# Altium schematic sheet BV10011_ControlEtherCAT.SchDoc: EtherCAT tranceiver
size A2; SheetNumber: 4; SheetTotal: 6
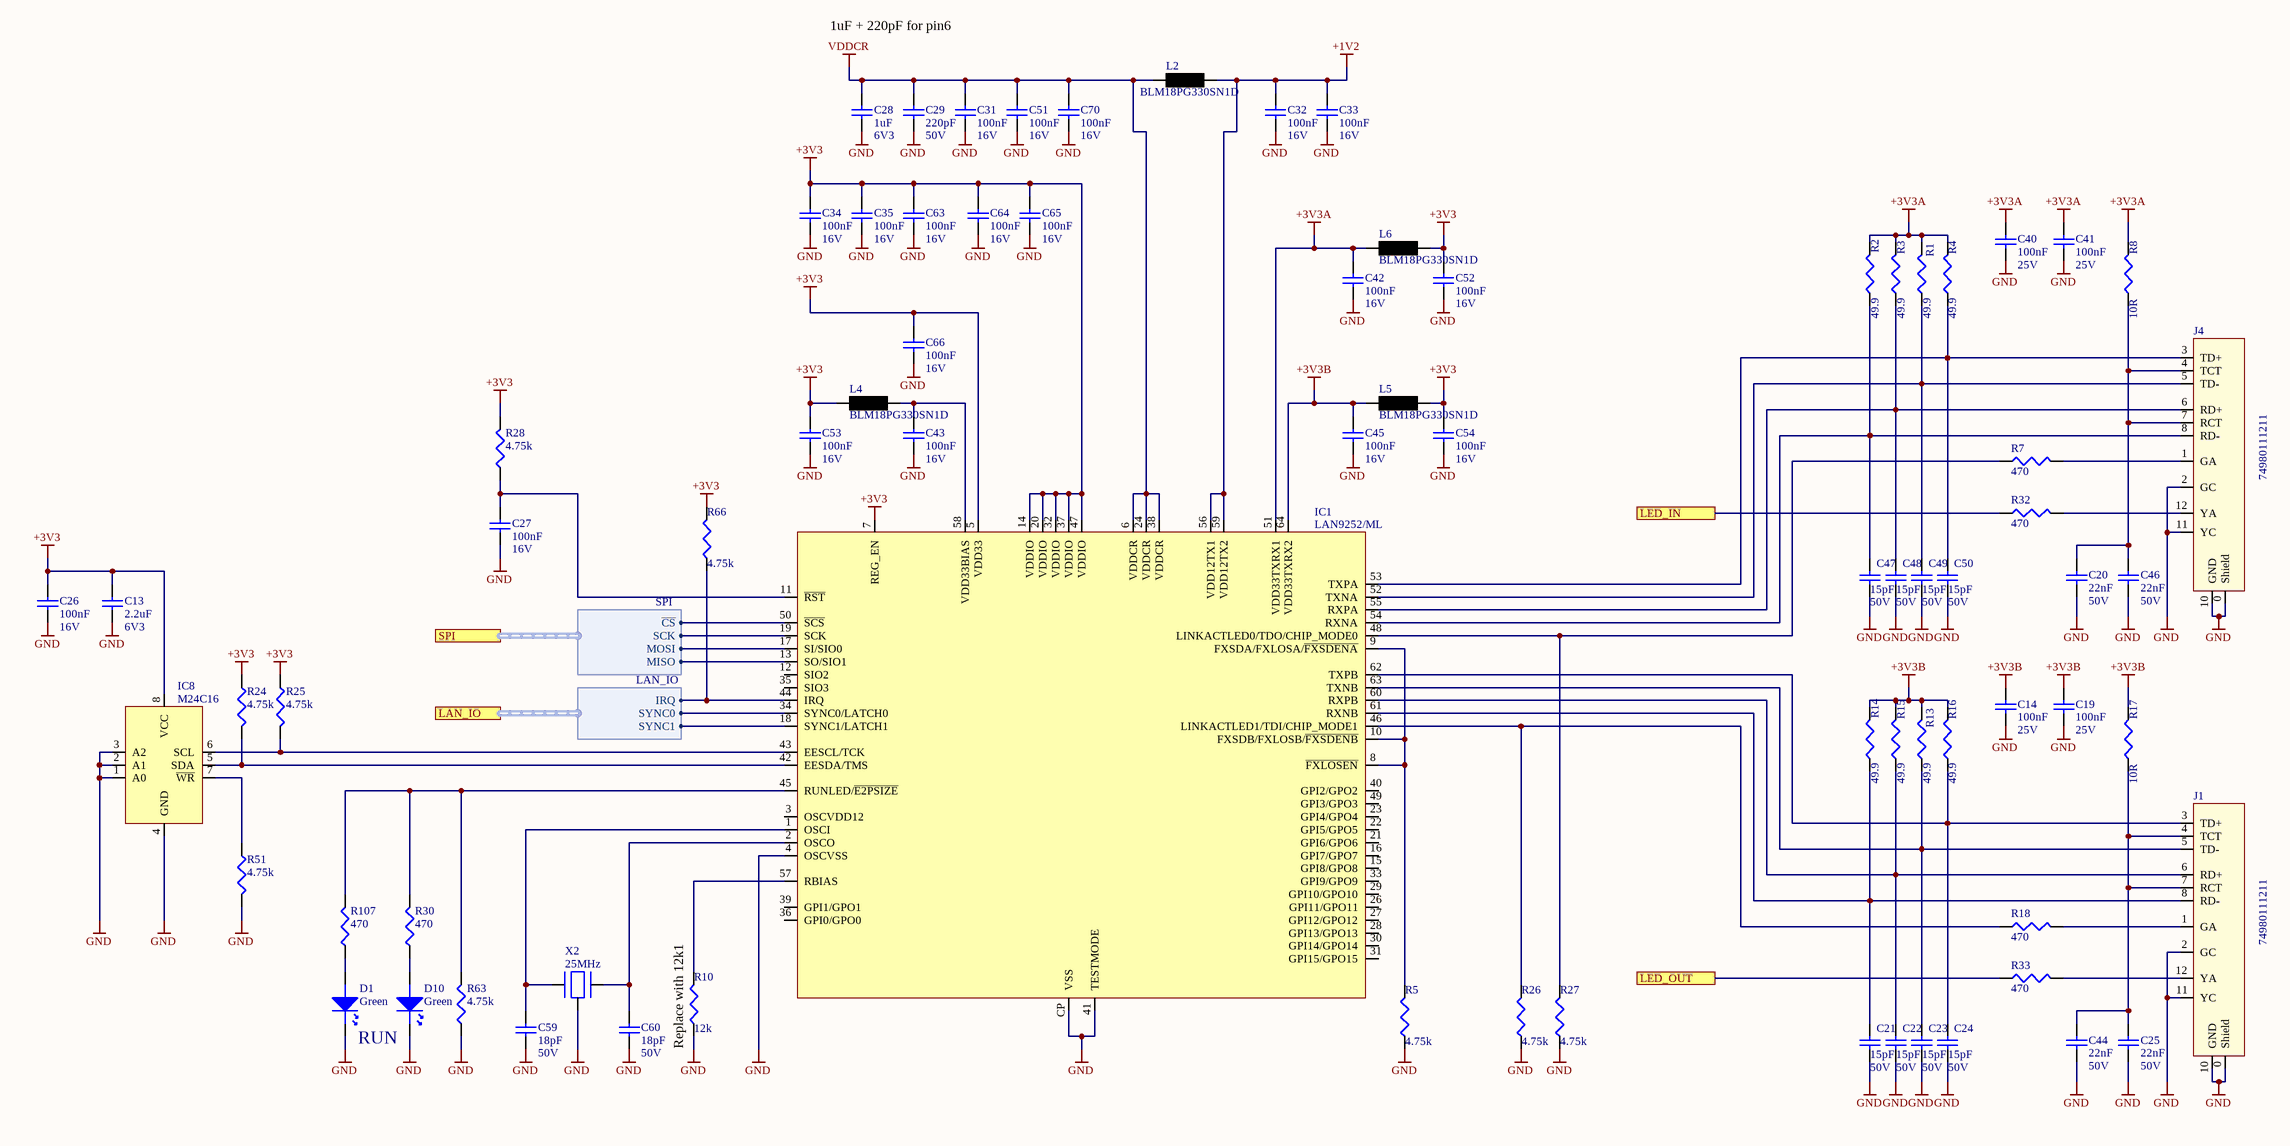
[diagram p0: BV10011_ControlEtherCAT.SchDoc]

## Parts
C13  2.2uF  Voltage Rating: 6V3  [C0402]
C14  100nF  Voltage Rating: 25V  [C0402]
C19  100nF  Voltage Rating: 25V  [C0402]
C20  22nF  Voltage Rating: 50V  [C0402]
C21  15pF  Voltage Rating: 50V  [C0402]
C22  15pF  Voltage Rating: 50V  [C0402]
C23  15pF  Voltage Rating: 50V  [C0402]
C24  15pF  Voltage Rating: 50V  [C0402]
C25  22nF  Voltage Rating: 50V  [C0402]
C26  100nF  Voltage Rating: 16V  [C0402]
C27  100nF  Voltage Rating: 16V  [C0402]
C28  1uF  Voltage Rating: 6V3  [C0402]
C29  220pF  Voltage Rating: 50V  [C0402]
C31  100nF  Voltage Rating: 16V  [C0402]
C32  100nF  Voltage Rating: 16V  [C0402]
C33  100nF  Voltage Rating: 16V  [C0402]
C34  100nF  Voltage Rating: 16V  [C0402]
C35  100nF  Voltage Rating: 16V  [C0402]
C40  100nF  Voltage Rating: 25V  [C0402]
C41  100nF  Voltage Rating: 25V  [C0402]
C42  100nF  Voltage Rating: 16V  [C0402]
C43  100nF  Voltage Rating: 16V  [C0402]
C44  22nF  Voltage Rating: 50V  [C0402]
C45  100nF  Voltage Rating: 16V  [C0402]
C46  22nF  Voltage Rating: 50V  [C0402]
C47  15pF  Voltage Rating: 50V  [C0402]
C48  15pF  Voltage Rating: 50V  [C0402]
C49  15pF  Voltage Rating: 50V  [C0402]
C50  15pF  Voltage Rating: 50V  [C0402]
C51  100nF  Voltage Rating: 16V  [C0402]
C52  100nF  Voltage Rating: 16V  [C0402]
C53  100nF  Voltage Rating: 16V  [C0402]
C54  100nF  Voltage Rating: 16V  [C0402]
C59  18pF  Voltage Rating: 50V  [C0402]
C60  18pF  Voltage Rating: 50V  [C0402]
C63  100nF  Voltage Rating: 16V  [C0402]
C64  100nF  Voltage Rating: 16V  [C0402]
C65  100nF  Voltage Rating: 16V  [C0402]
C66  100nF  Voltage Rating: 16V  [C0402]
C70  100nF  Voltage Rating: 16V  [C0402]
D1  Green  [D-0805]
D10  Green  [D-0805]
IC1  LAN9252/ML  [QFN64_Rect]
IC8  M24C16  [SO-8]
J1  74980111211  [74980111211]
J4  74980111211  [74980111211]
L2  BLM18PG330SN1D  [L0603]
L4  BLM18PG330SN1D  [L0603]
L5  BLM18PG330SN1D  [L0603]
L6  BLM18PG330SN1D  [L0603]
R1  49.9  [0402]
R2  49.9  [0402]
R3  49.9  [0402]
R4  49.9  [0402]
R5  4.75k  [0402]
R7  470  [0402]
R8  10R  [0603]
R10  12k  [0402]
R13  49.9  [0402]
R14  49.9  [0402]
R15  49.9  [0402]
R16  49.9  [0402]
R17  10R  [0603]
R18  470  [0402]
R24  4.75k  [0402]
R25  4.75k  [0402]
R26  4.75k  [0402]
R27  4.75k  [0402]
R28  4.75k  [0402]
R30  470  [0402]
R32  470  [0402]
R33  470  [0402]
R51  4.75k  [0402]
R63  4.75k  [0402]
R66  4.75k  [0402]
R107  470  [0402]
X2  25MHz  [7M]

## Ports
LAN_IO (harness LAN_IO), LED_IN, LED_OUT, SPI (harness SPI)

## Harnesses
SPI: SCK, ~{CS}, MOSI, MISO
LAN_IO: IRQ, SYNC0, SYNC1

## Nets
+1V2: C32.2 C33.2 IC1.56(VDD12TX1) IC1.59(VDD12TX2) L2.2
+3V3: C13.2 C26.2 C34.2 C35.2 C52.2 C53.2 C54.2 C63.2 C64.2 C65.2 C66.2 IC1.5(VDD33) IC1.7(REG_EN) IC1.14(VDDIO) IC1.20(VDDIO) IC1.32(VDDIO) IC1.37(VDDIO) IC1.47(VDDIO) IC8.8(VCC) L4.2 L5.2 L6.2 R24.2 R25.2 R28.2 R66.2
+3V3A: C40.2 C41.2 C42.2 IC1.51(VDD33TXRX1) L6.1 R1.2 R2.2 R3.2 R4.2 R8.2
+3V3B: C14.2 C19.2 C45.2 IC1.64(VDD33TXRX2) L5.1 R13.2 R14.2 R15.2 R16.2 R17.2
GND: C13.1 C14.1 C19.1 C20.1 C21.1 C22.1 C23.1 C24.1 C25.1 C26.1 C27.1 C28.1 C29.1 C31.1 C32.1 C33.1 C34.1 C35.1 C40.1 C41.1 C42.1 C43.1 C44.1 C45.1 C46.1 C47.1 C48.1 C49.1 C50.1 C51.1 C52.1 C53.1 C54.1 C59.1 C60.1 C63.1 C64.1 C65.1 C66.1 C70.1 D1.K D10.K IC1.4(OSCVSS) IC1.41(TESTMODE) IC1.CP(VSS) IC8.1(A0) IC8.2(A1) IC8.3(A2) IC8.4(GND) J1.0(Shield) J1.2(GC) J1.10(GND) J1.11(YC) J4.0(Shield) J4.2(GC) J4.10(GND) J4.11(YC) R5.1 R10.1 R26.1 R27.1 R51.1 R63.1 X2.0
VDDCR: C28.2 C29.2 C31.2 C51.2 C70.2 IC1.6(VDDCR) IC1.24(VDDCR) IC1.38(VDDCR) L2.1
LED_IN: R32.1 ; port LED_IN
LED_OUT: R33.1 ; port LED_OUT
NetC20_2: C20.2 C46.2 J4.4(TCT) J4.7(RCT) R8.1
NetC21_2: C21.2 IC1.61(RXNB) J1.8(RD-) R14.1
NetC22_2: C22.2 IC1.60(RXPB) J1.6(RD+) R15.1
NetC23_2: C23.2 IC1.63(TXNB) J1.5(TD-) R13.1
NetC24_2: C24.2 IC1.62(TXPB) J1.3(TD+) R16.1
NetC25_2: C25.2 C44.2 J1.4(TCT) J1.7(RCT) R17.1
NetC27_2: C27.2 IC1.11(~{RST}) R28.1
NetC43_2: C43.2 IC1.58(VDD33BIAS) L4.1
NetC47_2: C47.2 IC1.54(RXNA) J4.8(RD-) R2.1
NetC48_2: C48.2 IC1.55(RXPA) J4.6(RD+) R3.1
NetC49_2: C49.2 IC1.52(TXNA) J4.5(TD-) R1.1
NetC50_2: C50.2 IC1.53(TXPA) J4.3(TD+) R4.1
NetC59_2: C59.2 IC1.1(OSCI) X2.1
NetC60_2: C60.2 IC1.2(OSCO) X2.2
NetD1_A: D1.A R107.1
NetD10_A: D10.A R30.1
NetIC1_8: IC1.8(~{FXLOSEN}) IC1.9(FXSDA/FXLOSA/~{FXSDENA}) IC1.10(FXSDB/FXLOSB/~{FXSDENB}) R5.2
NetIC1_13: IC1.13(SO/SIO1) ; port SPI.MISO
NetIC1_17: IC1.17(SI/SIO0) ; port SPI.MOSI
NetIC1_18: IC1.18(SYNC1/LATCH1) ; port LAN_IO.SYNC1
NetIC1_19: IC1.19(SCK) ; port SPI.SCK
NetIC1_34: IC1.34(SYNC0/LATCH0) ; port LAN_IO.SYNC0
NetIC1_42: IC1.42(EESDA/TMS) IC8.5(SDA) R24.1
NetIC1_43: IC1.43(EESCL/TCK) IC8.6(SCL) R25.1
NetIC1_44: IC1.44(IRQ) R66.1 ; port LAN_IO.IRQ
NetIC1_45: IC1.45(RUNLED/~{E2PSIZE}) R30.2 R63.2 R107.2
NetIC1_46: IC1.46(LINKACTLED1/TDI/CHIP_MODE1) R18.1 R26.2
NetIC1_48: IC1.48(LINKACTLED0/TDO/CHIP_MODE0) R7.1 R27.2
NetIC1_50: IC1.50(~{SCS}) ; port SPI.~{CS}
NetIC1_57: IC1.57(RBIAS) R10.2
NetIC8_7: IC8.7(~{WR}) R51.2
NetJ1_1: J1.1(GA) R18.2
NetJ1_12: J1.12(YA) R33.2
NetJ4_1: J4.1(GA) R7.2
NetJ4_12: J4.12(YA) R32.2

Not connected (* = marked no-connect by the designer): IC1 3(OSCVDD12) 12(SIO2) 15(GPI8/GPO8) 16(GPI7/GPO7) 21(GPI6/GPO6) 22(GPI5/GPO5) 23(GPI4/GPO4) 26(GPI11/GPO11) 27(GPI12/GPO12) 28(GPI13/GPO13) 29(GPI10/GPO10) 30(GPI14/GPO14) 31(GPI15/GPO15) 33(GPI9/GPO9) 35(SIO3) 36(GPI0/GPO0) 39(GPI1/GPO1) 40(GPI2/GPO2) 49(GPI3/GPO3)

## Notes on the sheet
- 1uF + 220pF for pin6
- RUN
- (near R10) Replace with 12k1
- Title
- Size:
- Date:
- File:
- A2
- Number:
- Time:
- Revision:
- Sheet
- of

## Library data of the parts
C13 = 2.2uF/0402/CER/6.3V: Capacitor, 2.2uF, 6.3V, X5R; Capacitance Tolerance: ± 10%; Capacitor Case Style: 0402; Brand Number: GRM155R60J225ME15D; Brand: MURATA; Dielectric Characteristic: X5R; Capacitance: 2.2uF; Temperature Range: -55°C to +85°C; Price: 0,818; Order Code Supplier: 2362088; Supplier: Farnell
C14 C19 C40 C41 = 100nF/0402/CER/25V: Capacitor, 100nF, 25V, X7R; Capacitance Tolerance: 10nF; Capacitor Case Style: 0402; Brand Number: GRM155R71E104KE14D; Brand: MULTICOMP; Dielectric Characteristic: X7R; Capacitance: 100nF; Temperature Range: -55 to +125 C; Price: 0,0225; Order Code Supplier: 2456106; Supplier: Farnell
C20 C25 C44 C46 = 22nF/0402/CER/50V: Capacitor, 22nF, 50V, X7R; Capacitance Tolerance: ± 5%; Capacitor Case Style: 0402; Brand Number: GRM155R71H223KA12D; Brand: Murata; Dielectric Characteristic: X7R; Capacitance: 22nF; Temperature Range: -55°C to 125°C; Price: 0,0133; Order Code Supplier: 1828888; Supplier: Farnell
C21-C24 C47-C50 = 15pF/0402/CER/50V: Capacitor, 15pF, 50V, C0G; Capacitance Tolerance: ± 5%; Capacitor Case Style: 0402; Brand Number: GRM1555C1H150JA01D; Brand: Murata; Dielectric Characteristic: C0G; Capacitance: 15pF; Temperature Range: -55°C to 125°C; Price: 0,0097; Order Code Supplier: 2218840; Supplier: Farnell
C26 C27 C31-C35 C42 C43 C45 C51-C54 C63-C66 C70 = 100nF/0402/CER/16V: Capacitor, 100nF, 16V, X7R; Capacitance Tolerance: 10nF; Capacitor Case Style: 0402; Brand Number: GRM155R71C104KA88D; Brand: MURATA; Dielectric Characteristic: X7R; Capacitance: 100nF; Temperature Range: -55 to +125 C; Price: 0,001; Order Code Supplier: 2408523; Supplier: Farnell
C28 = 1uF/0402/CER/6.3V: Capacitor, 1uF, 6.3V, X5R; Capacitance Tolerance: ± 10%; Capacitor Case Style: 0402; Brand Number: 04026D105KAT2A; Brand: AVX; Dielectric Characteristic: X5R; Capacitance: 1uF; Temperature Range: -55°C to +85°C; Price: 0,0874; Order Code Supplier: 1327658; Supplier: Farnell
C29 = 220pF/0402/CER/50V: Capacitor, 220pF, 50V, NP0; Capacitance Tolerance: ± 5%; Capacitor Case Style: 0402; Brand Number: GRM1555C1H221JA01D; Brand: MURATA; Dielectric Characteristic: NP0; Capacitance: 220pF; Temperature Range: -55°C to 125°C; Price: 0,02; Order Code Supplier: 8819580; Supplier: Farnell
C59 C60 = 18pF/0402/CER/50V: Capacitor, 18pF, 50V, NP0; Capacitance Tolerance: ± 5%; Capacitor Case Style: 0402; Brand Number: GRM1555C1H180JA01D; Brand: MURATA; Dielectric Characteristic: NP0; Capacitance: 18pF; Temperature Range: -55°C to 125°C; Price: 0,0177; Order Code Supplier: 1828876; Supplier: Farnell
D1 D10 = KP-2012SGC: Led, Green, Li:12mcd, Vf:2.2V, If:0.02A; Brand: KingBright; Case Style: 0805; Forward Current: 0.02A; Forward Voltage: 2.2V; Luminous Intensity: 12mcd; Brand Number: KP-2012SGC; Order Code Supplier: 1318243; Price: 0,06; Supplier: Farnell; Temperature Range: -30°C to +85°C
IC1 = LAN9252/ML: EtherCAT Slave Controller; Brand: Microchip; Case Style: QFN64; Brand Number: LAN9252/ML; Order Code Supplier: 579-LAN9252/ML; Price: 7,23; Supplier: Mouser; Temperature Range: -55°C to +155°C
IC8 = M24C16-WMN6P: SERIAL EEPROM, 16KBIT, 400KHZ; Brand: ST Micro; Case Style: SO8; Brand Number: M24C16-WMN6P; Order Code Supplier: 9882774; Price: 0,811; Supplier: Farnell; Temperature Range: -55°C to +155°C
J1 J4 = 74980111211: RJ45 With LAN TRANSFRMR; Brand: Wurth; Case Style: SMT RJ45; Brand Number: 74980111211; Order Code Supplier: 2407403; Pitch: -; Price: 9,36; Supplier: Farnell
L2 L4-L6 = BLM18PG330SN1D: Ferrite Bead, Impedance:33ohm, DC Resistance Max:0.025ohm, DC Current Rating:3A; Brand: MURATA; Case Style: 0603; Brand Number: BLM18PG330SN1D; Order Code Supplier: 1515742; Price: 0,048; Supplier: Farnell
R1-R4 R13-R16 = 49.9/0402/0063W/50V: Resistor, 49.9, 0.1%, 0.0625W, 50V, 100PPM, 0402; Brand: VISHAY DRALORIC; Brand Number: CRCW040249R9FKED; Power Rating: 0.063W; Case Style: 0402; Order Code Supplier: 2121437; Price: 0,0004; Resistance: 49.9; Supplier: Farnell; Temperature Coefficient: ± 100PPM; Temperature Range: -55°C to +125°C; Voltage Rating: 50V
R5 R24-R28 R51 R63 R66 = 4.75k/0402/0063W/50V: Resistor, 4.75k, 0.1%, 0.0625W, 50V, 100PPM, 0402; Brand: VISHAY DRALORIC; Brand Number: CRCW04024K75FKED; Power Rating: 0.063W; Case Style: 0402; Order Code Supplier: 2121689; Price: 0,0006; Resistance: 4.75k; Supplier: Farnell; Temperature Coefficient: ± 100PPM; Temperature Range: -55°C to +125°C; Voltage Rating: 50V
R7 R18 R30 R32 R33 R107 = 470/0402/0063W/50V: Resistor, 470, 1%, 0.0625W, 50V, 100PPM, 0402; Brand: VISHAY DRALORIC; Brand Number: CRG0402F470R; Power Rating: 0.063W; Case Style: 0402; Order Code Supplier: 2331533; Price: 0,0099; Resistance: 470; Supplier: Farnell; Temperature Coefficient: ± 100PPM; Temperature Range: -55°C to +125°C; Voltage Rating: 50V
R8 R17 = 10/0603/0125W/50V: Resistor, 10R, 1%, 0.125W, 50V, 200PPM, 0603; Brand: MULTICOMP; Brand Number: MCHP03W8F100JT5E; Case Style: 0603; Order Code Supplier: 1576250; Power Rating: 0.125W; Price: 0,08; Resistance: 10R; Supplier: Farnell; Temperature Coefficient: ± 200PPM; Temperature Range: -55°C to +155°C; Voltage Rating: 50V
R10 = 12k/0402/0063W/50V: Resistor, 12k, 1%, 0.0625W, 50V, 100PPM, 0402; Brand: TE CONNECTIVITY; Brand Number: CRG0402F12K; Power Rating: 0.063W; Case Style: 0402; Order Code Supplier: 2331453; Price: 0,0075; Resistance: 12k; Supplier: Farnell; Temperature Coefficient: ± 100PPM; Temperature Range: -55°C to +125°C; Voltage Rating: 50V
X2 = 7M-25.000MAAJ-T: CRYSTAL, 25MHz,18PF CL, 3.2X2.5MM SMT; Brand: TXC; Price: 0,995; Supplier: Farnell; Order Code Supplier: 1842068; Brand Number: 7M-25.000MAAJ-T